# Altium schematic sheet ANCHOR.SchDoc
size A; SheetNumber: 1; SheetTotal: 6
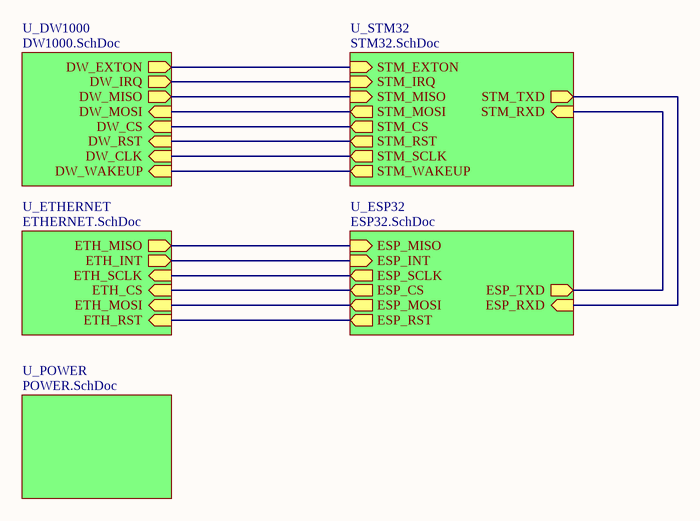
[diagram p0: ANCHOR.SchDoc]

## Sub-sheets
U_DW1000 = DW1000.SchDoc: DW_MOSI (in), DW_CS (in), DW_EXTON (out), DW_IRQ (out), DW_RST (in), DW_CLK (in), DW_MISO (out), DW_WAKEUP (in)
U_ESP32 = ESP32.SchDoc: ESP_RXD (in), ESP_TXD (out), ESP_MISO (in), ESP_MOSI (out), ESP_SCLK (out), ESP_CS (out), ESP_RST (out), ESP_INT (in)
U_ETHERNET = ETHERNET.SchDoc: ETH_RST (in), ETH_INT (out), ETH_MOSI (in), ETH_MISO (out), ETH_SCLK (in), ETH_CS (in)
U_POWER = POWER.SchDoc: no entries
U_STM32 = STM32.SchDoc: STM_CS (out), STM_SCLK (out), STM_MISO (in), STM_MOSI (out), STM_RST (out), STM_WAKEUP (out), STM_EXTON (in), STM_IRQ (in), STM_RXD (in), STM_TXD (out)

## Nets
(unnamed): sheet U_ETHERNET/ETH_RST, sheet U_ESP32/ESP_RST
(unnamed): sheet U_ETHERNET/ETH_INT, sheet U_ESP32/ESP_INT
(unnamed): sheet U_ETHERNET/ETH_MOSI, sheet U_ESP32/ESP_MOSI
(unnamed): sheet U_ETHERNET/ETH_MISO, sheet U_ESP32/ESP_MISO
(unnamed): sheet U_ETHERNET/ETH_SCLK, sheet U_ESP32/ESP_SCLK
(unnamed): sheet U_ETHERNET/ETH_CS, sheet U_ESP32/ESP_CS
(unnamed): sheet U_DW1000/DW_MOSI, sheet U_STM32/STM_MOSI
(unnamed): sheet U_DW1000/DW_CS, sheet U_STM32/STM_CS
(unnamed): sheet U_DW1000/DW_EXTON, sheet U_STM32/STM_EXTON
(unnamed): sheet U_DW1000/DW_IRQ, sheet U_STM32/STM_IRQ
(unnamed): sheet U_DW1000/DW_RST, sheet U_STM32/STM_RST
(unnamed): sheet U_DW1000/DW_CLK, sheet U_STM32/STM_SCLK
(unnamed): sheet U_DW1000/DW_MISO, sheet U_STM32/STM_MISO
(unnamed): sheet U_DW1000/DW_WAKEUP, sheet U_STM32/STM_WAKEUP
(unnamed): sheet U_ESP32/ESP_RXD, sheet U_STM32/STM_TXD
(unnamed): sheet U_ESP32/ESP_TXD, sheet U_STM32/STM_RXD